# Altium schematic sheet main_board3.SchDoc
size A3
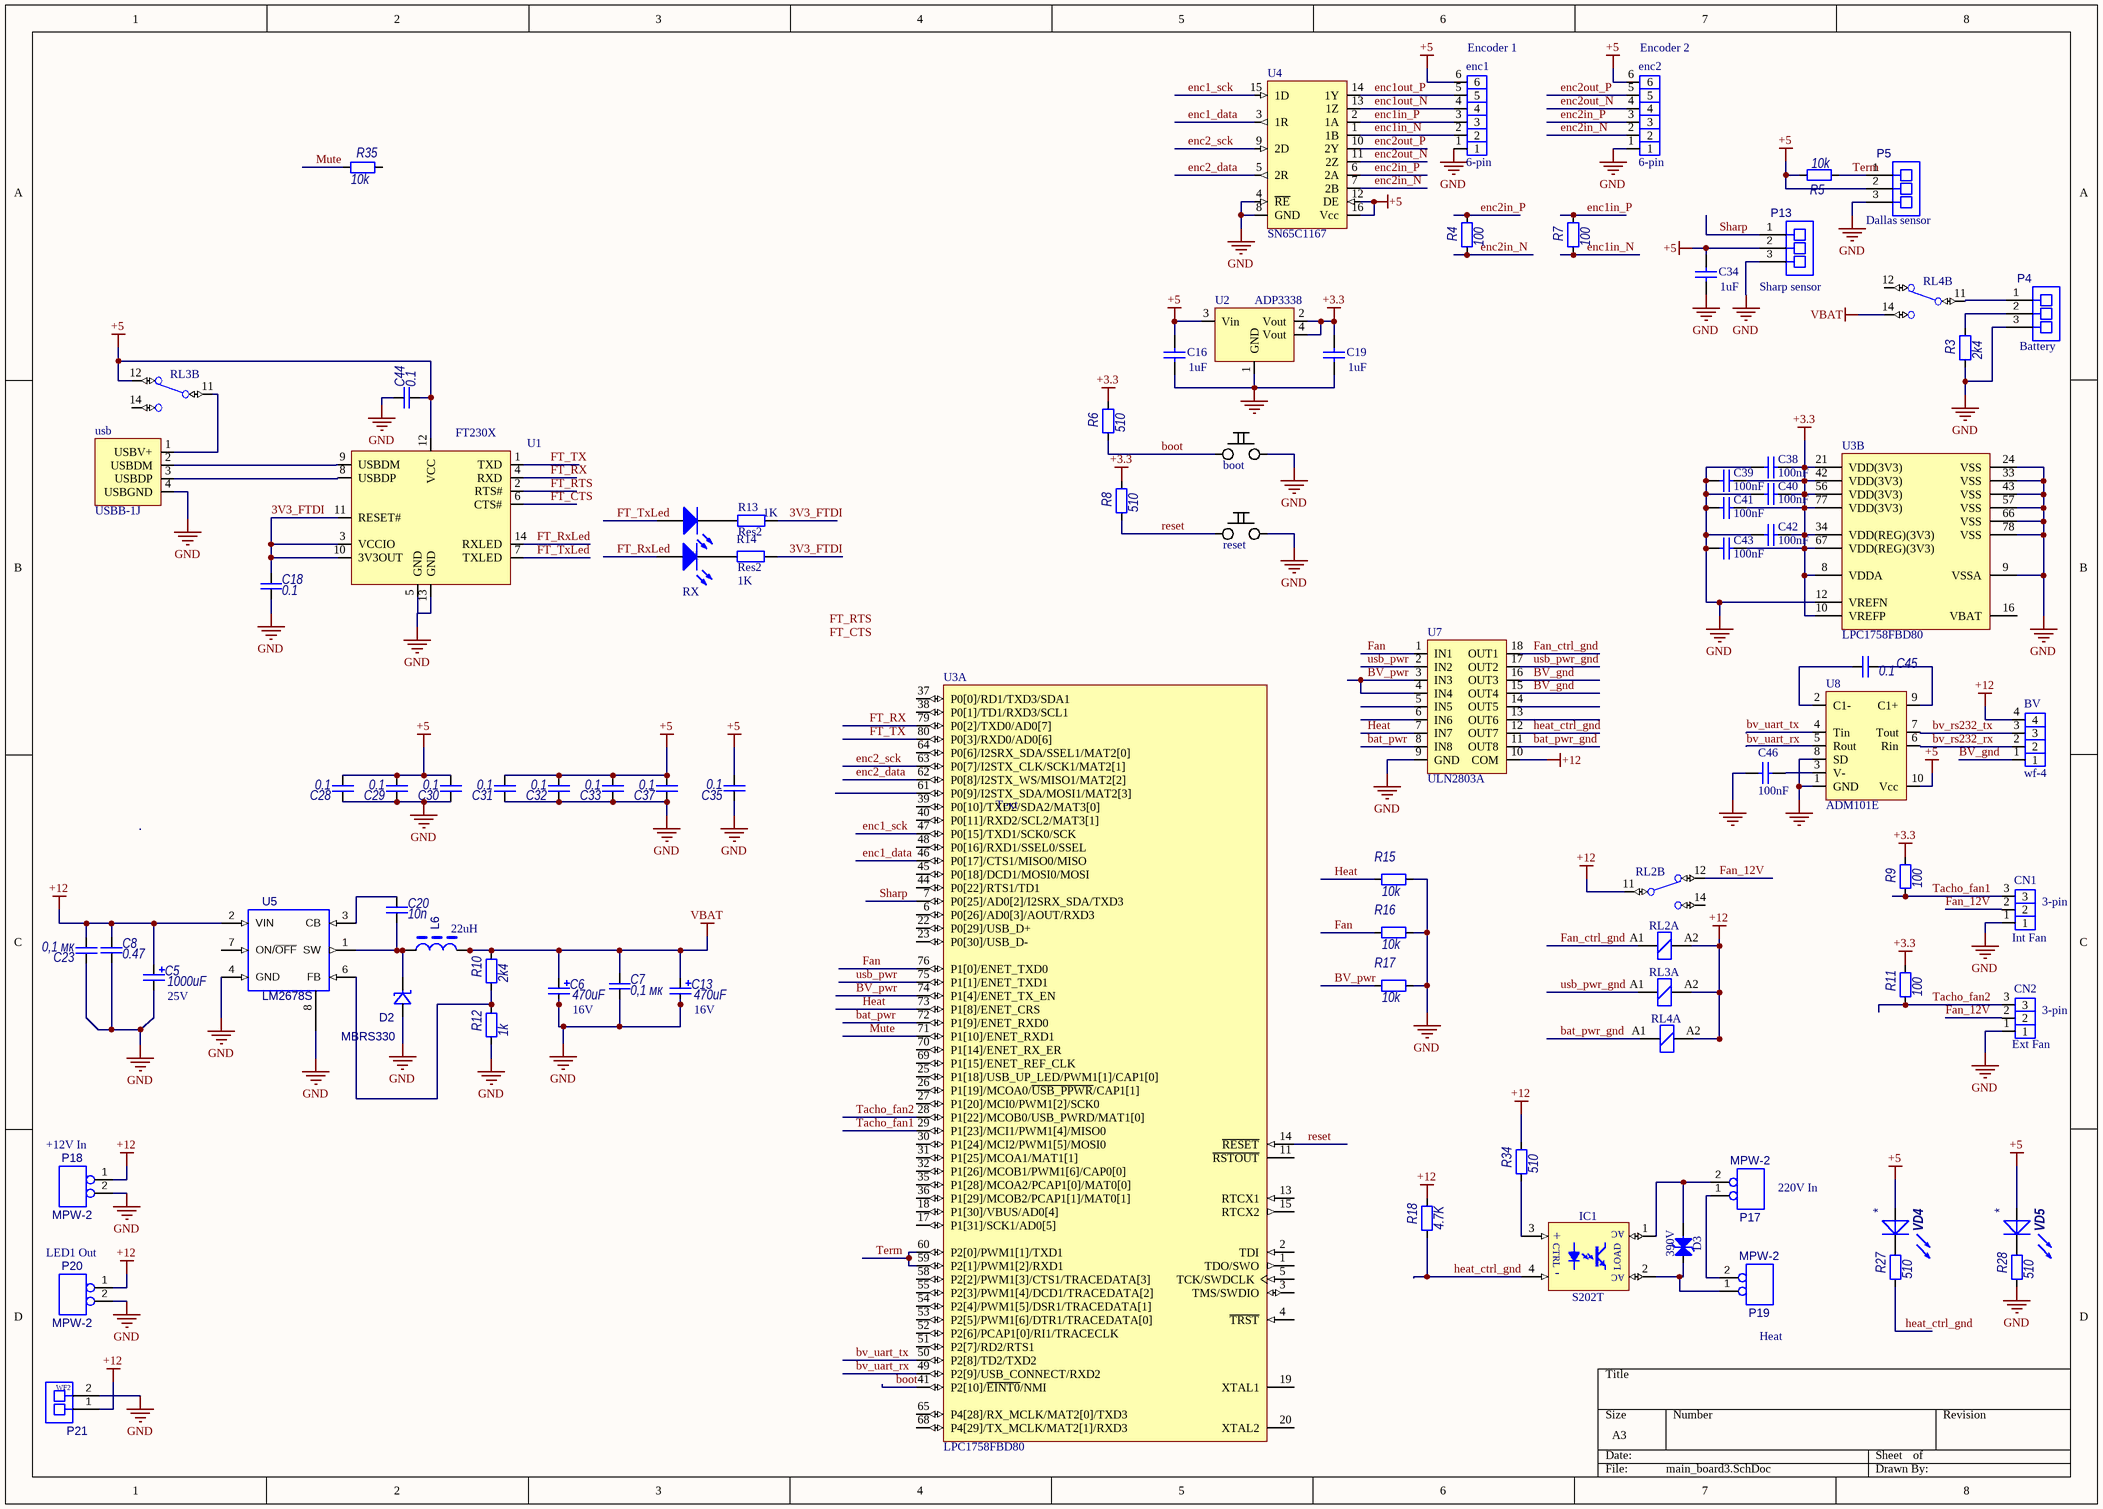
[diagram p0: main_board3.SchDoc]

## Parts
boot  chip button  [BUTTON SMD]  (value not drawn)
BV  wf-4  [wf-4]
C5  1000uF  Voltage: 25V  [CAP+_D13_dip]
C6  470uF  Voltage: 16V  [CAP+_D10_dip]
C7  0,1 мк  [Cap_0805]
C8  0.47  [Cap_0805]
C13  470uF  Voltage: 16V  [CAP+_D10_dip]
C16  value 1uF  [CAPC1608M]  (hidden comment: Cap)
C18  0.1  [Cap_0805]
C19  value 1uF  [CAPC1608M]  (hidden comment: Cap)
C20  10n  [Cap_0805]
C23  0,1 мк  [Cap_0805]
C28  0.1  [Cap_0805]
C29  0.1  [Cap_0805]
C30  0.1  [Cap_0805]
C31  0.1  [CAPC1608M]
C32  0.1  [Cap_0805]
C33  0.1  [Cap_0805]
C34  value 1uF  [CAPC1608M]  (hidden comment: Cap)
C35  0.1  [Cap_0805]
C37  0.1  [Cap_0805]
C38  value 100nF  [CAPC1608N]  (hidden comment: p)
C39  value 100nF  [CAPC1608N]  (hidden comment: p)
C40  value 100nF  [CAPC1608N]  (hidden comment: p)
C41  value 100nF  [CAPC1608N]  (hidden comment: p)
C42  value 100nF  [CAPC1608N]  (hidden comment: p)
C43  value 100nF  [CAPC1608N]  (hidden comment: p)
C44  0.1  [CAPC1608M]
C45  0.1  [CAPC1608M]
C46  value 100nF  [CAPC1608M]  (hidden comment: p)
CN1  3-pin  [wf-3]
CN2  3-pin  [wf-3]
D2  MBRS330  [MBRS3]
D3  390V  [Var_130]
enc1  6-pin  [wf-6]
enc2  6-pin  [wf-6]
IC1  S202T  [CRYDOM_LC]
L6  value 22uH  [PM12651]  (hidden comment: DR-PM12651S)
P4  MPW3  [MPW-3 - duplicate]  (value not drawn)
P5  WF-3  [WF-3]  (value not drawn)
P13  WF-3  [WF-3]  (value not drawn)
P17  MPW-2  [MPW-2]
P18  MPW-2  [MPW-2]
P19  MPW-2  [MPW-2]
P20  MPW-2  [MPW-2]
P21  WF2  [WF2]
R3  2k4  [Res_0805]
R4  100  [RESC2012M]
R5  10k  [Res_0805]
R6  510  [RESC2012M]
R7  100  [RESC2012M]
R8  510  [RESC2012M]
R9  100  [RESC2012M]
R10  2k4  [Res_0805]
R11  100  [RESC2012M]
R12  1k  [Res_0805]
R13  Res2  value 1K  [RESC3216M]
R14  Res2  value 1K  [RESC3216M]
R15  10k  [RESC2012M]
R16  10k  [RESC2012M]
R17  10k  [RESC2012M]
R18  4.7K  [RESC1608M]
R27  510  [Res_0805]
R28  510  [Res_0805]
R34  510  [Res_1206]
R35  10k  [Res_0805]
reset  chip button  [BUTTON SMD]  (value not drawn)
RL2  5VDC  [REL_TYCO-SCHRACK_SNR]  (value not drawn)  (parts A,B of 2)
RL3  5VDC  [REL_TYCO-SCHRACK_SNR]  (value not drawn)  (parts A,B of 2)
RL4  5VDC  [REL_TYCO-SCHRACK_SNR]  (value not drawn)  (parts A,B of 2)
RX  led  [RESC2012M]  (value not drawn)
TX  led  [RESC2012M]  (value not drawn)
U1  FT230X  [SOP635P600-16N]
U2  ADP3338  [SOT223-4M]
U3  LPC1758FBD80  [SOT315-1_V]  (parts A,B of 2)
U4  SN65C1167  [SOIC127P600-16M - increase width]
U5  LM2678S  [TO263-7]
U7  ULN2803A  [SOIC127P1030-18L]
U8  ADM101E  [TSSOP50P490-10AM]
usb  USBB-1J  [USB2.5-2V4A]
VD4  *  [CD1608-0603]
VD5  *  [CD1608-0603]

## Nets
+3.3: C19.1 C38.2 C39.2 C40.2 C41.2 C42.2 C43.2 R6.2 R8.2 R9.2 R11.2 U2.2(Vout) U2.4(Vout) U3.8(VDDA) U3.10(VREFP) U3.21(VDD(3V3)) U3.34(VDD(REG)(3V3)) U3.42(VDD(3V3)) U3.56(VDD(3V3)) U3.67(VDD(REG)(3V3)) U3.77(VDD(3V3))
+5: C16.1 C28.2 C29.2 C30.2 C31.2 C32.2 C33.2 C34.1 C35.2 C37.2 C44.2 enc1.6 enc2.6 P5.2 P13.2 R5.2 RL3.12(NC) U1.12(VCC) U2.3(Vin) U4.12(DE) U4.16(Vcc) U8.10(Vcc) VD4.1(A) VD5.1(A)
+12: BV.4 C5.1 C8.1 C23.2 P18.1 P20.1 P21.1 R18.2 R34.2 RL2.11(C) RL2.A2 RL3.A2 RL4.A2 U5.2(VIN) U7.10(COM)
GND: boot.2 C5.2 C6.2 C7.2 C8.2 C13.2 C16.2 C18.2 C19.2 C23.1 C28.1 C29.1 C30.1 C31.1 C32.1 C33.1 C34.2 C35.1 C37.1 C38.1 C39.1 C40.1 C41.1 C42.1 C43.1 C44.1 C46.2 CN1.1 CN2.1 D2.1 enc1.1 enc2.1 P4.3 P5.3 P13.3 P18.2 P20.2 P21.2 R3.1 R12.1 R15.2 R16.2 R17.2 R28.1 reset.2 U1.5(GND) U1.13(GND) U2.1(GND) U3.9(VSSA) U3.12(VREFN) U3.24(VSS) U3.33(VSS) U3.43(VSS) U3.57(VSS) U3.66(VSS) U3.78(VSS) U4.4(~{RE}) U4.8(GND) U5.4(GND) U5.8 U7.9(GND) U8.1(GND) U8.8(SD) usb.4(USBGND)
VBAT: C6.1 C7.1 C13.1 L6.2 R10.2 RL4.14(NO)
3V3_FTDI: C18.1 R13.1 R14.1 U1.3(VCCIO) U1.10(3V3OUT) U1.11(RESET#)
bat_pwr: U3.72(P1[9]/ENET_RXD0) U7.8(IN8)
bat_pwr_gnd: RL4.A1 U7.11(OUT8)
boot: boot.1 R6.1 U3.41(P2[10]/~{EINT0}/NMI)
BV_gnd: BV.1 U7.15(OUT4) U7.16(OUT3)
BV_pwr: R17.1 U3.74(P1[4]/ENET_TX_EN) U7.3(IN3) U7.4(IN4)
bv_rs232_rx: BV.2 U8.6(Rin)
bv_rs232_tx: BV.3 U8.7(Tout)
bv_uart_rx: U3.49(P2[9]/USB_CONNECT/RXD2) U8.5(Rout)
bv_uart_tx: U3.50(P2[8]/TD2/TXD2) U8.4(Tin)
enc1_data: U3.46(P0[17]/CTS1/MISO0/MISO) U4.3(1R)
enc1_sck: U3.47(P0[15]/TXD1/SCK0/SCK) U4.15(1D)
enc1in_N: enc1.2 R7.1 U4.1(1B)
enc1in_P: enc1.3 R7.2 U4.2(1A)
enc1out_N: enc1.4 U4.13(1Z)
enc1out_P: enc1.5 U4.14(1Y)
enc2_data: U3.62(P0[8]/I2STX_WS/MISO1/MAT2[2]) U4.5(2R)
enc2_sck: U3.63(P0[7]/I2STX_CLK/SCK1/MAT2[1]) U4.9(2D)
enc2in_N: enc2.2 R4.1 U4.7(2B)
enc2in_P: enc2.3 R4.2 U4.6(2A)
enc2out_N: enc2.4 U4.11(2Z)
enc2out_P: enc2.5 U4.10(2Y)
Fan: R16.1 U3.76(P1[0]/ENET_TXD0) U7.1(IN1)
Fan_12V: CN1.2 CN2.2 RL2.12(NC)
Fan_ctrl_gnd: RL2.A1 U7.18(OUT1)
FT_CTS: U1.6(CTS#)
FT_RTS: U1.2(RTS#)
FT_RX: U1.4(RXD) U3.79(P0[2]/TXD0/AD0[7])
FT_RxLed: RX.1(A) U1.14(RXLED)
FT_TX: U1.1(TXD) U3.80(P0[3]/RXD0/AD0[6])
FT_TxLed: TX.1(A) U1.7(TXLED)
Heat: R15.1 U3.73(P1[8]/ENET_CRS) U7.7(IN7)
heat_ctrl_gnd: IC1.4(-) R18.1 R27.1 U7.12(OUT7)
Mute: R35.1 U3.71(P1[10]/ENET_RXD1)
reset: R8.1 reset.1 U3.14(~{RESET})
Sharp: P13.1 U3.7(P0[25]/AD0[2]/I2SRX_SDA/TXD3)
Tacho_fan1: CN1.3 R9.1 U3.29(P1[23]/MCI1/PWM1[4]/MISO0)
Tacho_fan2: CN2.3 R11.1 U3.28(P1[22]/MCOB0/USB_PWRD/MAT1[0])
Term: P5.1 R5.1 U3.59(P2[1]/PWM1[2]/RXD1) U3.60(P2[0]/PWM1[1]/TXD1)
usb_pwr: U3.75(P1[1]/ENET_TXD1) U7.2(IN2)
usb_pwr_gnd: RL3.A1 U7.17(OUT2)
NetC20_1: C20.1 U5.3(CB)
NetC20_2: C20.2 D2.2 L6.1 U5.1(SW)
NetC45_1: C45.1 U8.9(C1+)
NetC45_2: C45.2 U8.2(C1-)
NetC46_1: C46.1 U8.3(V-)
NetD3_1: D3.1 IC1.1(AC) P17.2
NetD3_2: D3.2 IC1.2(AC) P19.1
NetIC1_3: IC1.3(+) R34.1
NetP4_1: P4.1 RL4.11(C)
NetP4_2: P4.2 R3.2
NetP17_1: P17.1 P19.2
NetR10_1: R10.1 R12.2 U5.6(FB)
NetR13_2: R13.2 TX.2(K)
NetR14_2: R14.2 RX.2(K)
NetR27_2: R27.2 VD4.2(C)
NetR28_2: R28.2 VD5.2(C)
NetRL3_11: RL3.11(C) usb.1(USBV+)
NetU1_8: U1.8(USBDP) usb.3(USBDP)
NetU1_9: U1.9(USBDM) usb.2(USBDM)

Not connected (* = marked no-connect by the designer): R35 2; RL2 14(NO); RL3 14(NO); RL4 12(NC); U1 15(CBUS0) 16(CBUS3); U3 1(TDO/SWO) 2(TDI) 3(TMS/SWDIO) 4(~{TRST}) 5(TCK/SWDCLK) 6(P0[26]/AD0[3]/AOUT/RXD3) 11(~{RSTOUT}) 13(RTCX1) 15(RTCX2) 16(VBAT) 17(P1[31]/SCK1/AD0[5]) 18(P1[30]/VBUS/AD0[4]) 19(XTAL1) 20(XTAL2) 22(P0[29]/USB_D+) 23(P0[30]/USB_D-) 25(P1[18]/USB_UP_LED/PWM1[1]/CAP1[0]) 26(P1[19]/MCOA0/~{USB_PPWR}/CAP1[1]) 27(P1[20]/MCI0/PWM1[2]/SCK0) 30(P1[24]/MCI2/PWM1[5]/MOSI0) 31(P1[25]/MCOA1/MAT1[1]) 32(P1[26]/MCOB1/PWM1[6]/CAP0[0]) 35(P1[28]/MCOA2/PCAP1[0]/MAT0[0]) 36(P1[29]/MCOB2/PCAP1[1]/MAT0[1]) 37(P0[0]/RD1/TXD3/SDA1) 38(P0[1]/TD1/RXD3/SCL1) 39(P0[10]/TXD2/SDA2/MAT3[0]) 40(P0[11]/RXD2/SCL2/MAT3[1]) 44(P0[22]/RTS1/TD1) 45(P0[18]/DCD1/MOSI0/MOSI) 48(P0[16]/RXD1/SSEL0/SSEL) 51(P2[7]/RD2/RTS1) 52(P2[6]/PCAP1[0]/RI1/TRACECLK) 53(P2[5]/PWM1[6]/DTR1/TRACEDATA[0]) 54(P2[4]/PWM1[5]/DSR1/TRACEDATA[1]) 55(P2[3]/PWM1[4]/DCD1/TRACEDATA[2]) 58(P2[2]/PWM1[3]/CTS1/TRACEDATA[3]) 61(P0[9]/I2STX_SDA/MOSI1/MAT2[3]) 64(P0[6]/I2SRX_SDA/SSEL1/MAT2[0]) 65(P4[28]/RX_MCLK/MAT2[0]/TXD3) 68(P4[29]/TX_MCLK/MAT2[1]/RXD3) 69(P1[15]/ENET_REF_CLK) 70(P1[14]/ENET_RX_ER); U5 5 7(ON/~{OFF}); U7 5(IN5) 6(IN6) 13(OUT6) 14(OUT5)

## Notes on the sheet
- (near enc1) Encoder 1
- (near enc2) Encoder 2
- (near P5) Dallas sensor
- (near P13) Sharp sensor
- (near P4) Battery
- (near U3) Text
- (near CN1) Int Fan
- (near CN2) Ext Fan
- (near P18) +12V In
- (near P17) 220V In
- (near P20) LED1 Out
- (near P19) Heat
- Labels drawn without touching a wire or pin: FT_CTS, FT_RTS
- (in symbol LC242) CTRL; LOAD

## Library data of the parts
BV = 4-pin
C5 = Cap+: Tantalum and aluminium electrolytic capacitors; ValueSCH: 330,0 мк
C6 C13 = Cap+: Tantalum and aluminium electrolytic capacitors; ValueSCH: 470,0 мк
C7 C8 C18 C20 C23 C28-C33 C35 C37 C44 C45 = Cap: Ceramic capacitors; ValueBOM: *; MarkPCB: *
  C7 C23: ValueSCH: 0,1 мк
  C8: ValueSCH: 0.47
  C18 C28-C33 C35 C37 C44 C45: ValueSCH: 0.1
  C20: ValueSCH: 10n
C16 C19 C34 C38-C43 C46 = Cap: Capacitor; Published: 8-Jun-2000; LatestRevisionDate: 17-Jul-2002; LatestRevisionNote: Re-released for DXP Platform.; PackageReference: RAD-0.3; Publisher: Altium Limited; PackageDescription: Radial Cap, Thru-Hole; 2 Leads; 0.3 in Pin Spacing
D2 = MBRS360T3: Value: *
D3 = Varistor 430V: Varistor; Device: 390V
IC1 = LC242: Opto Relay x1 Type1; Part Number: LC242; Part Description: 4-10VDC Control Voltage, 12-280VAC Operating Voltage, 2A Operating Current, Mini-SIP Solid State Relay(SSR), LC Serie; Manufacturer: CRYDOM; Table: Optocouplers; Component Kind: Standard; Component Type: Standard; Device: S202T; PackageDescription: CRYDOM LC Serie, 4 Leads, Body 24.1mm x 5.1mm, Mini-SIP SSR (Solid State Relay); Manufacturer Part Number: LC242; Pin Count: 4; Mounted: Yes; Socket: No; SMD: No; ComponentHeight: 12.7mm; HelpURL: \\cern.ch\dfs\Applications\Altium\Datasheets\LC242.pdf; Author: CERN DEM JLC; CreateDate: 12.03.2014; LatestRevisionDate: 12.03.2014
R3-R12 R27 R28 R34 R35 = Res: Ceramic resisors; ValueBOM: *; MarkPCB: *
  R3 R10: ValueSCH: 2k4
  R4 R7 R9 R11: ValueSCH: 100
  R5 R35: ValueSCH: 10k
  R6 R8 R27 R28 R34: ValueSCH: 510
  R12: ValueSCH: 1k
R13 R14 = Res2: Resistor; Published: 8-Jun-2000; LatestRevisionDate: 17-Jul-2002; LatestRevisionNote: Re-released for DXP Platform.; PackageReference: AXIAL-0.4; Publisher: Altium Limited; PackageDescription: Axial Device, Thru-Hole; 2 Leads; 0.4 in Pin Spacing
R15-R18 = Res: Ceramic resisors; ValueSCH: 510; ValueBOM: *; MarkPCB: *
RL2-RL4 = REL_TYCO-SCHRACK_V23092-A1005-A301: SNR Slim PCB Relay Form C (1 CO Contact); Part Description: SPDT General Purpose  Slim PCB Relay, SNR Serie; Manufacturer: TYCO SCHRACK; Manufacturer Part Number: V23092-A1005-A301 or 0-1393236-2; Table: Relays; Part Number: REL_TYCO-SCHRACK_V23092-A1005-A301; Component Kind: Standard; Component Type: Standard; Pin Count: 5; PackageDescription: 5 Leads, Body 28.0 x 5mm, Slim PCB Relay SNR Serie; Mounted: Yes; Socket: No; SMD: No; Status: None; Value: 5VDC; ComponentHeight: 15mm; HelpURL: \\cern.ch\dfs\Applications\Altium\Datasheets\REL_TYCO-SCHRACK_SNR.pdf; Author: CERN DEM JLC; CreateDate: 28.01.2009; LatestRevisionDate: 28.01.2009
RX TX = chip led
U2 = ADP3339: ADP3339AKCZ-3.3-R7
U3 = LPC1758FBD80: 32-bit ARM Cortex-M3 MCU, 512 kB Flash, 64 kB SRAM, 100 MHz, USB 2.0 Device/Host/OTG, Ethernet, CAN, 12-Bit ADC, DAC, I2S, 80-Pin LQFP; fmax: 100 MHz; SRAM: 64 kB; Flash: 512 kB; GPIOs: 52; USB: 1; CAN: 2; UART: 4; PWM: 6; PLL: Y; VDD (min): 2.4 V; VDD (typ): 3.3 V; VDD (max): 3.6 V; Code_IEC: 136E15; DatasheetVersion: Rev. 7, Mar-2011; PackageVersion: Feb-2003; PackageReference: SOT315-1; PackageDescription: LQFP80: Plastic Low Profile Quad Flat Package; 80 Leads; Body 12 x 12 x 1.4 mm; SPI: 1; SSP: 2; ADC channels: 6; Timers: 4; Code_JEDEC: MS-026; PartNumber: LPC1758FBD80; ComponentLink1Description: Manufacturer URL; ComponentLink1URL: http://www.nxp.com/; ComponentLink2Description: Datasheet; ComponentLink2URL: http://www.nxp.com/documents/data_sheet/LPC1759_58_56_54_52_51.pdf
U4 = SN65C1167: RS-422 Dual Differential Drivers and Receivers
U5 = LM2676S: Value: *
U7 = ULN2803A: EIGHT DARLINGTON ARRAYS
U8 = ADM101E: Tiny RS-232 Transceiver
VD4 VD5 = LED: ValueSCH: *
P4 = MPW3: Value: *
P5 P13 = WF-3: Value: *
P17-P20 = MPW-2: Value: *
P21 = WF2: Value: *
usb = USBB-1J: url: http://www.brownbear.ru/components/usbb-1j.html